# EasyEDA schematic SmartPlant-Schematic_2026-07-18.json

## Sheets
1 Sheet_1: TITLE: Sheet_1; REV: 1.0; Date: 2026-07-18; Sheet: 1/1; Drawn By: silas.loeffler; Company: HS Ansbach
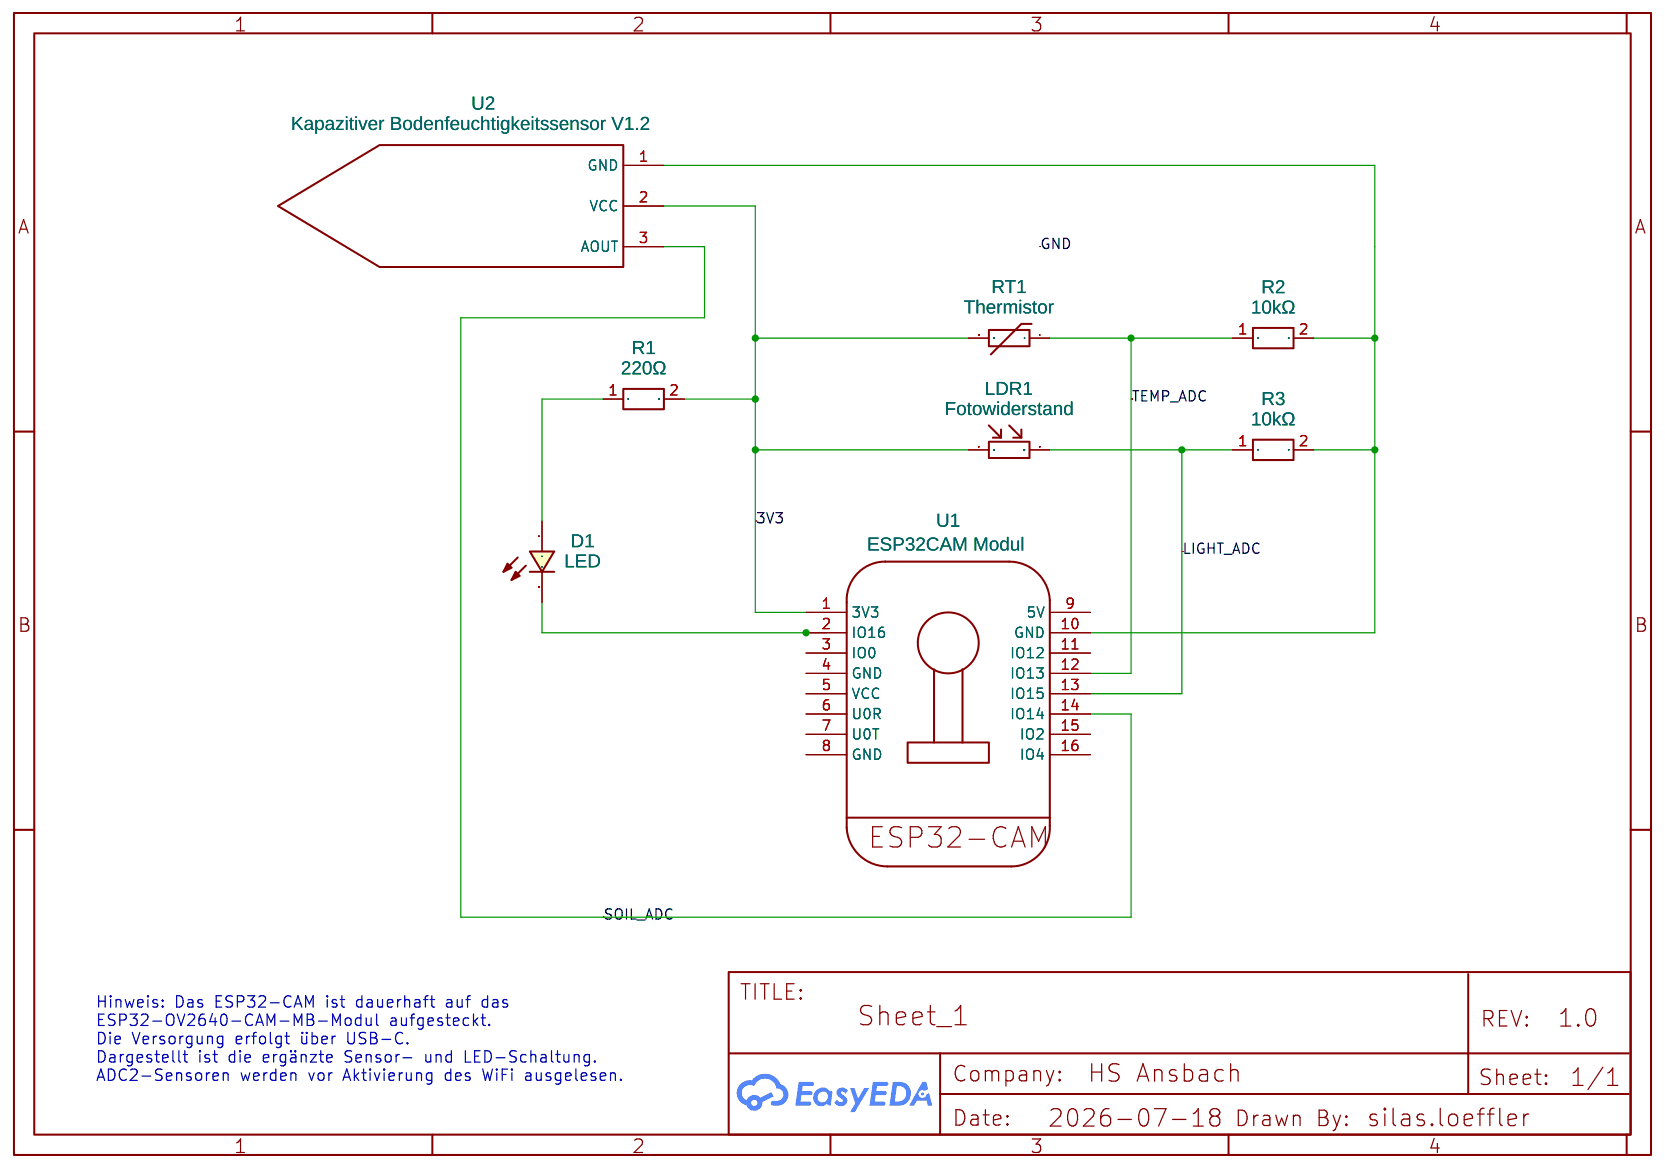
[diagram p0: Sheet_1]
2 Sheet_2: TITLE: TinyML Maze Shield; Date: 2026-05-12; Drawn By: Silas Löffler
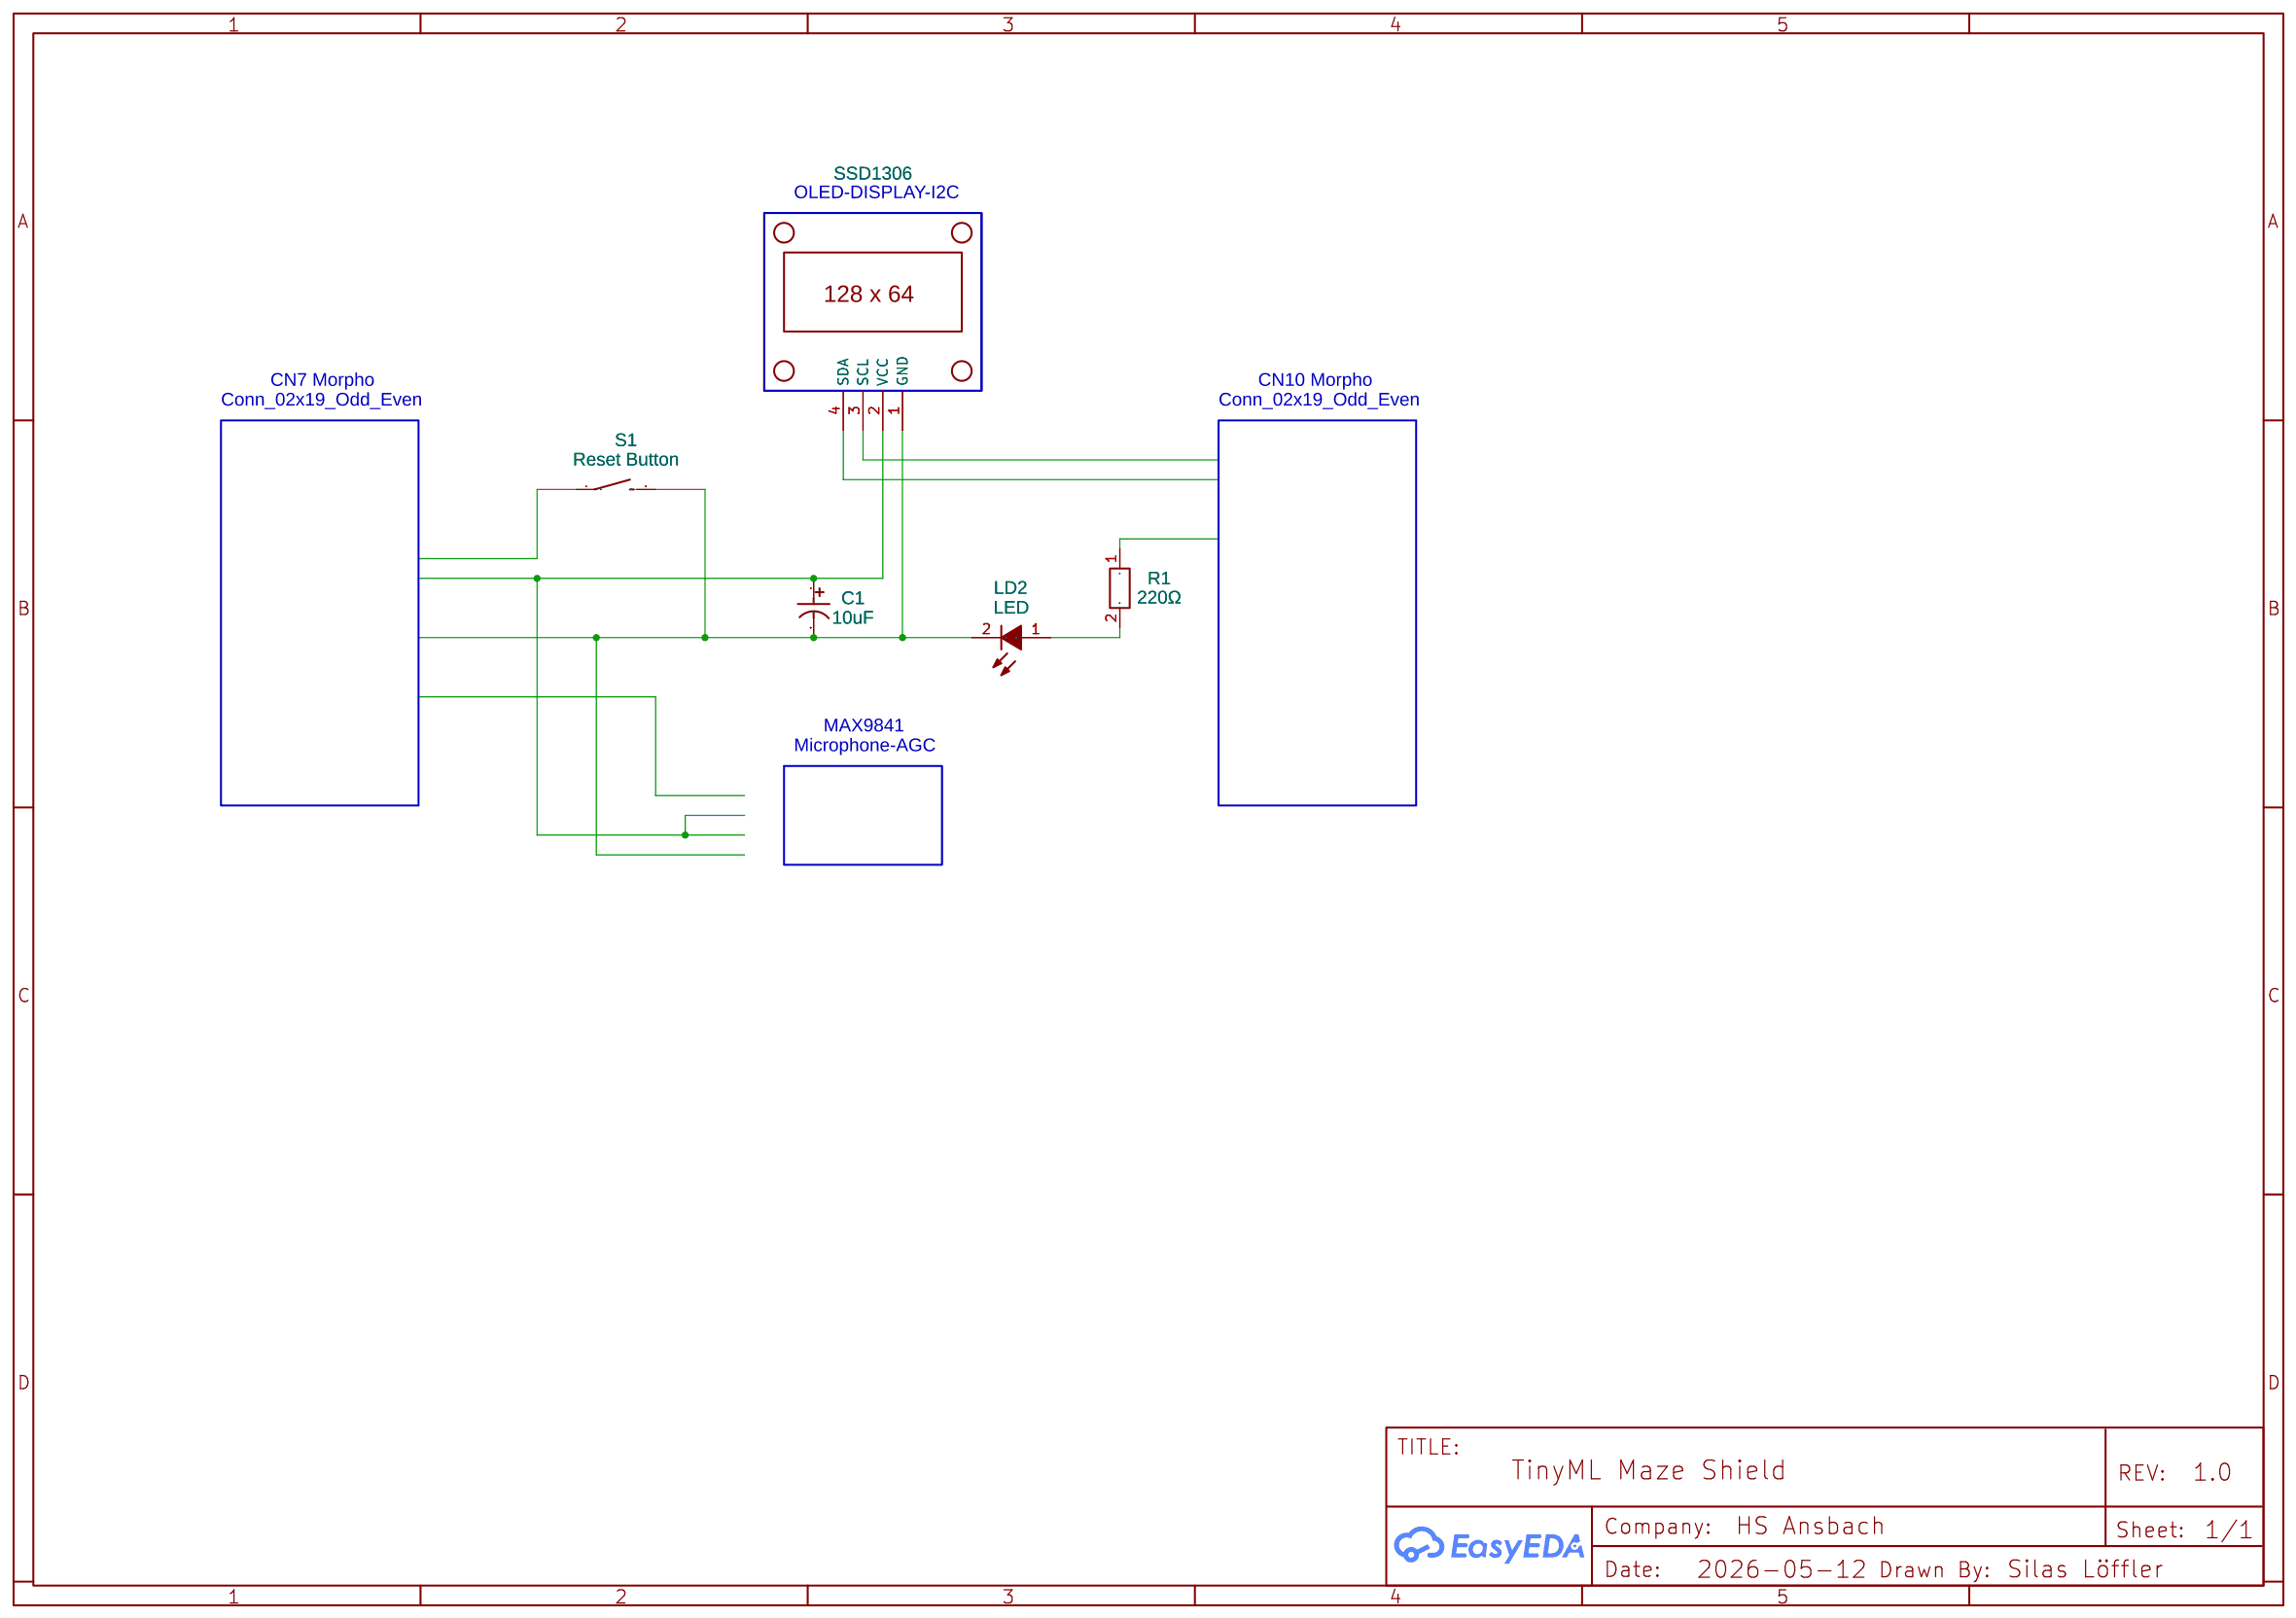
[diagram p1: Sheet_2]

## Parts
sheet Sheet_1
D1  LED  [LED-TH_LED-DP2-2LED]
LDR1  Fotowiderstand  [SENSORM-TH_EVERLIGHT_ALS-PDIC144-6C--L378]
R1  220Ω  [220Ω-RESISTOR]
R2  10kΩ  [220Ω-RESISTOR]
R3  10kΩ  [220Ω-RESISTOR]
RT1  Thermistor  [RES-TH_L22.0-W7.0-P7.50-D1.0-S1.00]
U1  ESP32CAM Modul  [ESP32CAM]
U2  Kapazitiver Bodenfeuchtigkeitssensor V1.2  [SOIL_MOISTURE_SENSOR_V1.2]
sheet Sheet_2
C1  10uF  [CAPACITOR 10UF 50V]
LCD1  SSD1306  [SSD1306-OLED-128X64-I2C-NOHOLES]
LD2  LED  [LED-TH_LED-DP2-2LED-AMCC]
R1#2  220Ω  [220Ω-RESISTOR]
S1  Reset Button  [SPARKFUN-SWITCHES_TACTILE_SWITCH_PTH_6.0MM]

## Library data of the parts
D1 = LED: Supplier: Digi-Key; Manufacturer: VccLite; Manufacturer Part: 5600; Supplier Part: L20325-ND; link: https://vcclite.com/product/5602f5-5v/; Contributor: ANDRE39
LDR1 = Fotowiderstand LDR 5506: Supplier: LCSC; Supplier Part: C2943463; Manufacturer: EVERLIGHT(台湾亿光); Manufacturer Part: ALS-PDIC144-6C/L378; Contributor: imkertools
R1 R1#2 R2 R3 = 220Ω-RESISTOR: Contributor: frengkihotsabarsimatupang1
RT1 = NTCThermistor: Supplier: LCSC; Manufacturer: RUILON(瑞隆源); Manufacturer Part: NTC 10D-20; Supplier Part: C42975; JLCPCB Part Class: Extended Part
U1 = ESP32CAM: Contributor: 64301050027
U2 = SOIL MOISTURE SENSOR V1.2: Supplier: AZ-Delivery; Contributor: budbundy
C1 = ELCO 10UF 50V _DEXTER: Supplier: LCSC; Manufacturer: ValuePro; Manufacturer Part: electrolytic capacitor10UF50V; Supplier Part: C32856; Contributor: maftukin
LCD1 = SSD1306-OLED-128X64-I2C-NOHOLES: Contributor: BGWorks
LD2 = LED: Supplier: Digi-Key; Manufacturer: VccLite; Manufacturer Part: 5600; Supplier Part: L20325-ND; link: https://vcclite.com/product/5602f5-5v/; Contributor: mt24cmn006; Package Display: No
S1 = SWITCH: Contributor: palaitot123; Manufacturer Part: X; Supplier: ITCH; Supplier Part: X; Manufacturer: X; link: X

## Nets
3V3: LDR1.1(VCC) R1.2 RT1.2 U1.1(3V3) U2.2(VCC)
LIGHT_ADC: LDR1.2(VOUT) R3.1 U1.13(IO15)
SOIL_ADC: U1.14(IO14) U2.3(AOUT)
TEMP_ADC: R2.1 RT1.1 U1.12(IO13)
Net-(C1-1): C1.1 LCD1.2(VCC)
Net-(C1-2): C1.2 LCD1.1(GND) LD2.2(K) S1.2
Net-(D1-1): D1.1(A) R1.1
Net-(D1-2): D1.2(K) U1.2(IO16)
Net-(LD2-1): LD2.1(A) R1#2.2
Net-(R2-2): R2.2 R3.2 U1.10(GND) U2.1(GND)

Not connected (* = marked no-connect by the designer): LCD1 3(SCL) 4(SDA); R1#2 1; S1 1; U1 3(IO0) 4(GND) 5(VCC) 6(U0R) 7(U0T) 8(GND) 9(5V) 11(IO12) 15(IO2) 16(IO4)

## Notes on the sheets
sheet 1
- Hinweis: Das ESP32-CAM ist dauerhaft auf das
  ESP32-OV2640-CAM-MB-Modul aufgesteckt.
  Die Versorgung erfolgt über USB-C.
  Dargestellt ist die ergänzte Sensor- und LED-Schaltung.
  ADC2-Sensoren werden vor Aktivierung des WiFi ausgelesen.
sheet 2
- OLED-DISPLAY-I2C
- Conn_02x19_Odd_Even
- CN7 Morpho
- Conn_02x19_Odd_Even
- CN10 Morpho
- MAX9841
- Microphone-AGC
